# EAGLE design vor_add_on (EAGLE 6.1)
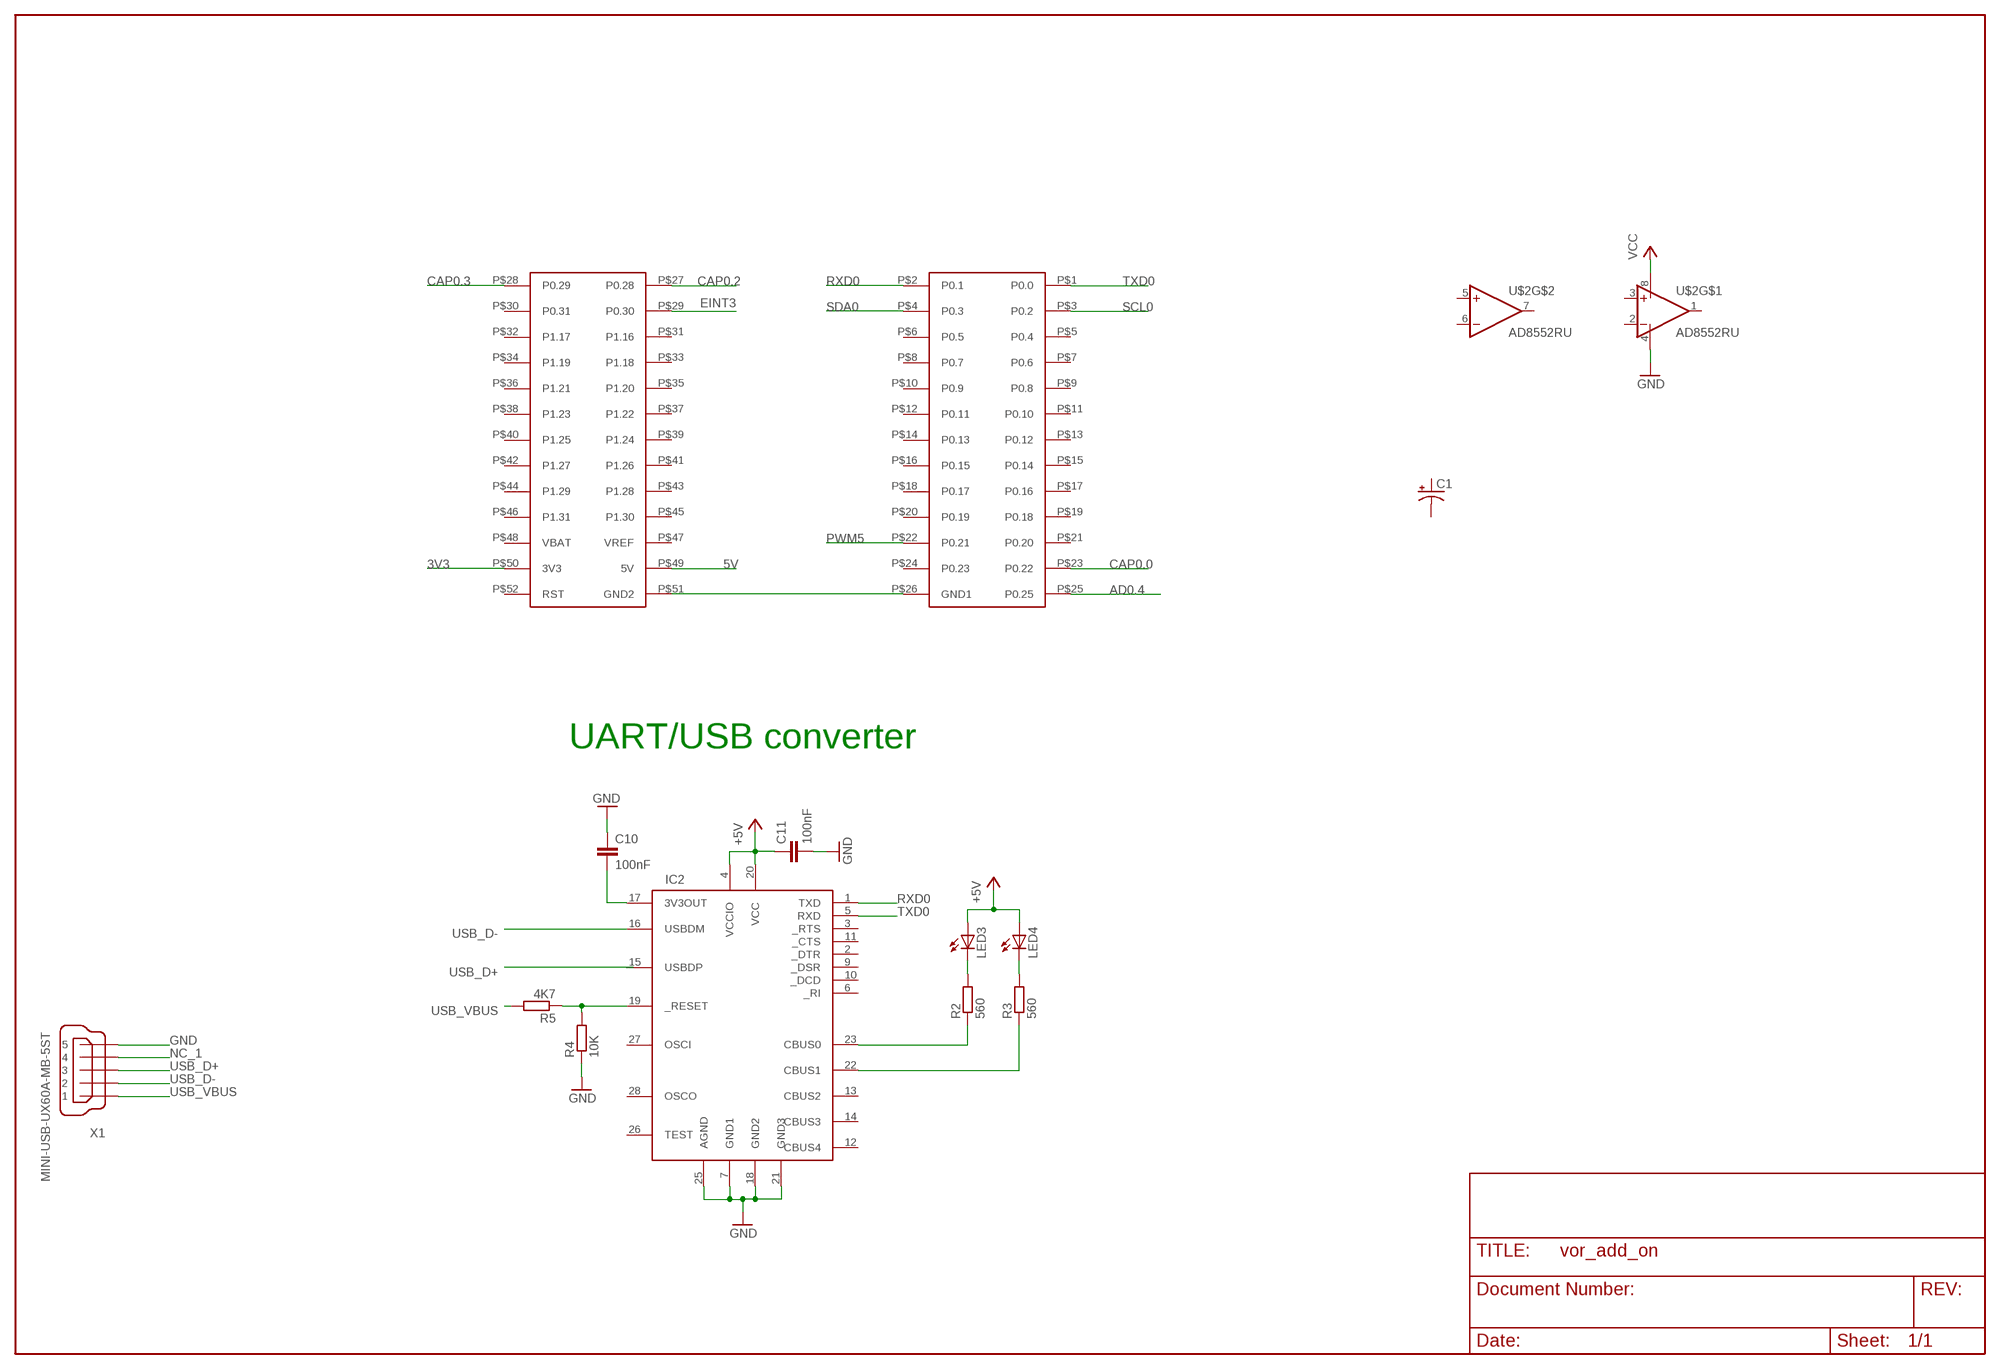
[diagram p0: schematic, sheet 1]

## Parts
C1  CPOL-USCT7343  [CT7343]
C10  100nF  C-EUC0603K  [C0603K]
C11  100nF  C-EUC0603K  [C0603K]
IC2  FT232RL  [SSOP28DB]
LED3  LEDCHIPLED_0805  [CHIPLED_0805]
LED4  LEDCHIPLED_0805  [CHIPLED_0805]
R2  560  R-EU_R0805  [R0805]
R3  560  R-EU_R0805  [R0805]
R4  10K  R-EU_R0603  [R0603]
R5  4K7  R-EU_R0603  [R0603]
U$1  OLIMEX_2148  [OLIMEX_2148]
U$2  AD8552RU  [TSSOP8]
X1  MINI-USB-UX60A-MB-5ST  [UX60A-MB-5ST]

## Nets
3V3: U$1.P$50(3V3)
5V: U$1.P$49(5V)
+5V: C11.1 IC2.4(VCCIO) IC2.20(VCC) LED3.A LED4.A
AD0.4: U$1.P$25(P0.25)
CAP0.0: U$1.P$23(P0.22)
CAP0.2: U$1.P$27(P0.28)
CAP0.3: U$1.P$28(P0.29)
EINT3: U$1.P$29(P0.30)
GND: C10.1 C11.2 IC2.7(GND1) IC2.18(GND2) IC2.21(GND3) IC2.25(AGND) R4.1 U$1.P$26(GND1) U$1.P$51(GND2) U$2.4(V-) X1.5
N$25: IC2.23(CBUS0) R2.1
N$26: IC2.22(CBUS1) R3.1
N$27: LED3.C R2.2
N$28: LED4.C R3.2
N$30: IC2.19(_RESET) R4.2 R5.1
N$32: C10.2 IC2.17(3V3OUT)
NC_1: X1.4
PWM5: U$1.P$22(P0.21)
RXD0: IC2.1(TXD) U$1.P$2(P0.1)
SCL0: U$1.P$3(P0.2)
SDA0: U$1.P$4(P0.3)
TXD0: IC2.5(RXD) U$1.P$1(P0.0)
USB_D+: X1.3
USB_D-: IC2.16(USBDM) X1.2
USB_VBUS: R5.2 X1.1
VCC: U$2.8(V+)
Unconnected: C1.+ C1.- IC2.2(_DTR) IC2.3(_RTS) IC2.6(_RI) IC2.9(_DSR) IC2.10(_DCD) IC2.11(_CTS) IC2.12(CBUS4) IC2.13(CBUS2) IC2.14(CBUS3) IC2.15(USBDP) IC2.26(TEST) IC2.27(OSCI) IC2.28(OSCO) U$1.P$5(P0.4) U$1.P$6(P0.5) U$1.P$7(P0.6) U$1.P$8(P0.7) U$1.P$9(P0.8) U$1.P$10(P0.9) U$1.P$11(P0.10) U$1.P$12(P0.11) U$1.P$13(P0.12) U$1.P$14(P0.13) U$1.P$15(P0.14) U$1.P$16(P0.15) U$1.P$17(P0.16) U$1.P$18(P0.17) U$1.P$19(P0.18) U$1.P$20(P0.19) U$1.P$21(P0.20) U$1.P$24(P0.23) U$1.P$30(P0.31) U$1.P$31(P1.16) U$1.P$32(P1.17) U$1.P$33(P1.18) U$1.P$34(P1.19) U$1.P$35(P1.20) U$1.P$36(P1.21) U$1.P$37(P1.22) U$1.P$38(P1.23) U$1.P$39(P1.24) U$1.P$40(P1.25) U$1.P$41(P1.26) U$1.P$42(P1.27) U$1.P$43(P1.28) U$1.P$44(P1.29) U$1.P$45(P1.30) U$1.P$46(P1.31) U$1.P$47(VREF) U$1.P$48(VBAT) U$1.P$52(RST) U$2.1(OUT) U$2.2(-IN) U$2.3(+IN) U$2.5(+IN) U$2.6(-IN) U$2.7(OUT)

## Notes on the sheet
- UART/USB converter

## Library data of the parts
C1 = rcl:CPOL-US: POLARIZED CAPACITOR, American symbol
C10 C11 = rcl:C-EU: CAPACITOR, European symbol
IC2 = ftdichip:FT232RL: USB UART 4th Generation USB UART (USB <-> Serial) Controller
LED3 LED4 = led:LED: LED OSRAM: - CHIPLED LG R971, LG N971, LY N971, LG Q971, LY Q971, LO R971, LY R971 LH N974, LH R974 LS Q976, LO Q976, LY Q976 LO Q996 - Hyper CHIPLED LW Q18S LB Q993, LB Q99A, LB R99A - SideLED LS A670, LO A670, LY A670, LG A670, LP A670 LB A673, LV A673, LT A673, LW A673 LH A674 LY A675 LS A676, LA A676, LO A676, LY A676, LW A676 LS A679, LY A679, LG A679 - Hyper Micro SIDELED® LS Y876, LA Y876, LO Y876, LY Y876 LT Y87S - SmartLED LW L88C, LW L88S LB L89C, LB L89S, LG L890 LS L89K, LO L89K, LY L89K LS L896, LA L896, LO L896, LY L896 - TOPLED LS T670, LO T670, LY T670, LG T670, LP T670 LSG T670, LSP T670, LSY T670, LOP T670, LYG T670 LG T671, LOG T671, LSG T671 LB T673, LV T673, LT T673, LW T673 LH T674 LS T676, LA T676, LO T676, LY T676, LB T676, LH T676, LSB T676, LW T676 LB T67C, LV T67C, LT T67C, LS T67K, LO T67K, LY T67K, LW E67C LS E67B, LA E67B, LO E67B, LY E67B, LB E67C, LV E67C, LT E67C LW T67C LS T679, LY T679, LG T679 LS T770, LO T770, LY T770, LG T770, LP T770 LB T773, LV T773, LT T773, LW T773 LH T774 LS E675, LA E675, LY E675, LS T675 LS T776, LA T776, LO T776, LY T776, LB T776 LHGB T686 LT T68C, LB T68C - Hyper Mini TOPLED® LB M676 - Mini TOPLED Santana® LG M470 LS M47K, LO M47K, LY M47K Source: http://www.osram.convergy.de/
R2-R5 = rcl:R-EU_: RESISTOR, European symbol
U$1 = paparazzi:OLIMEX_2148
U$2 = paparazzi:AD8552
X1 = con-hirose:MINI-USB-: MINI USB Connector Source: http://www.hirose.co.jp/cataloge_hp/e24000019.pdf

## Net classes
1 Supply: width 1.016 mm, drill 0.762 mm, clearance 0.635 mm

## Board
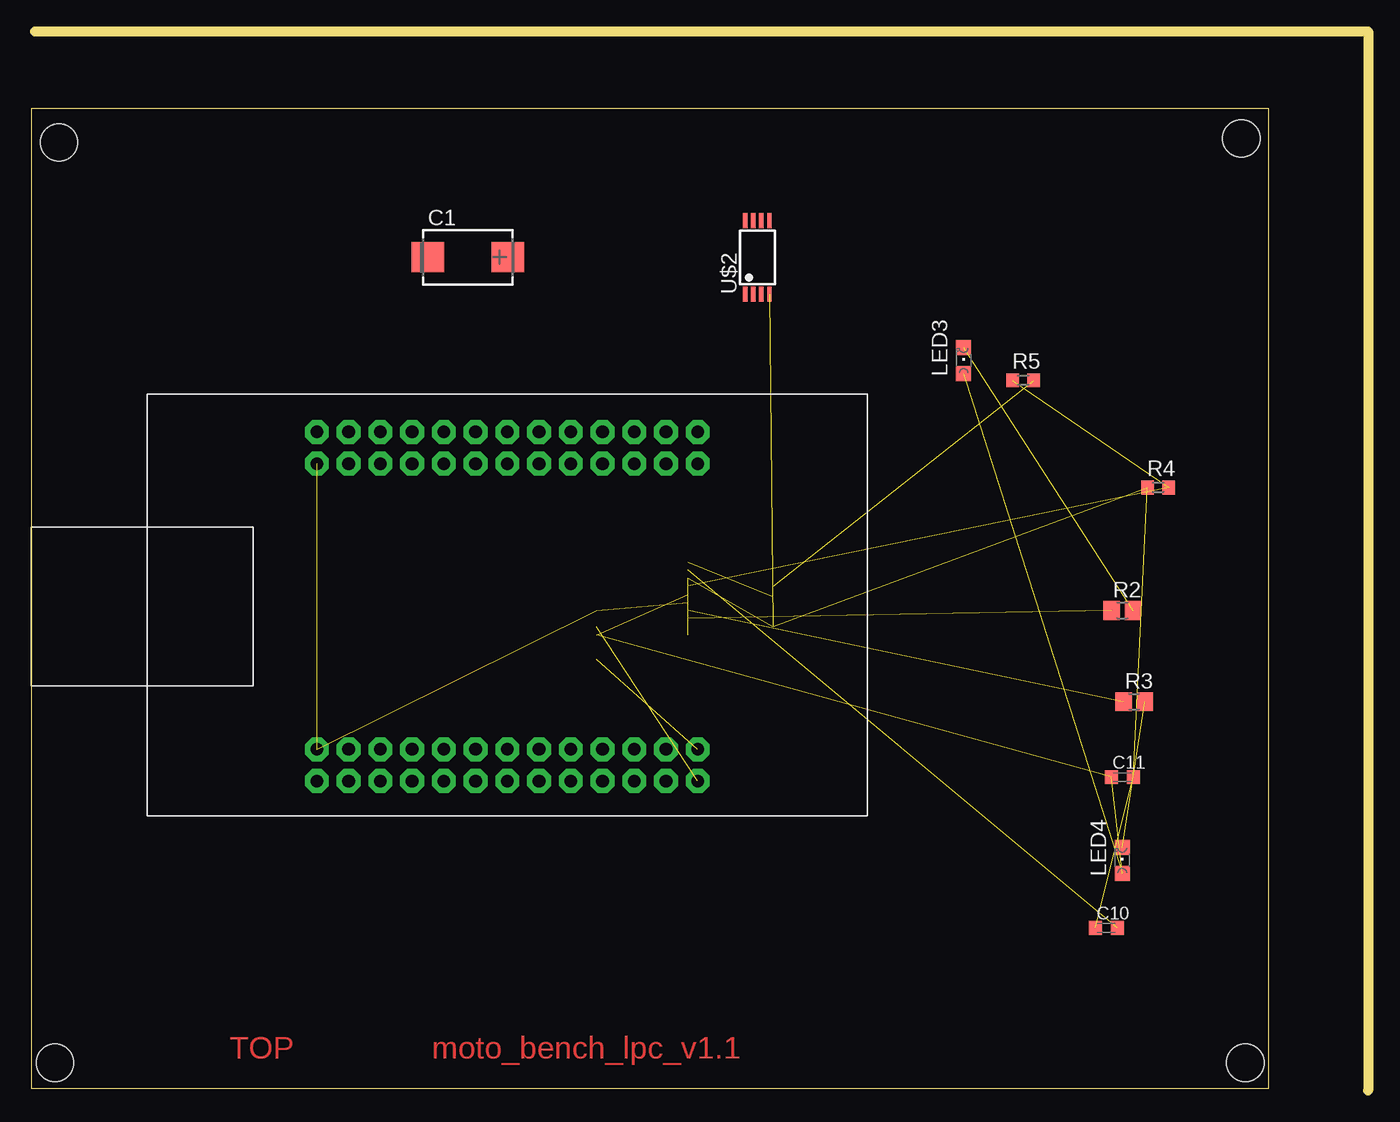
[diagram p1: board, top side]
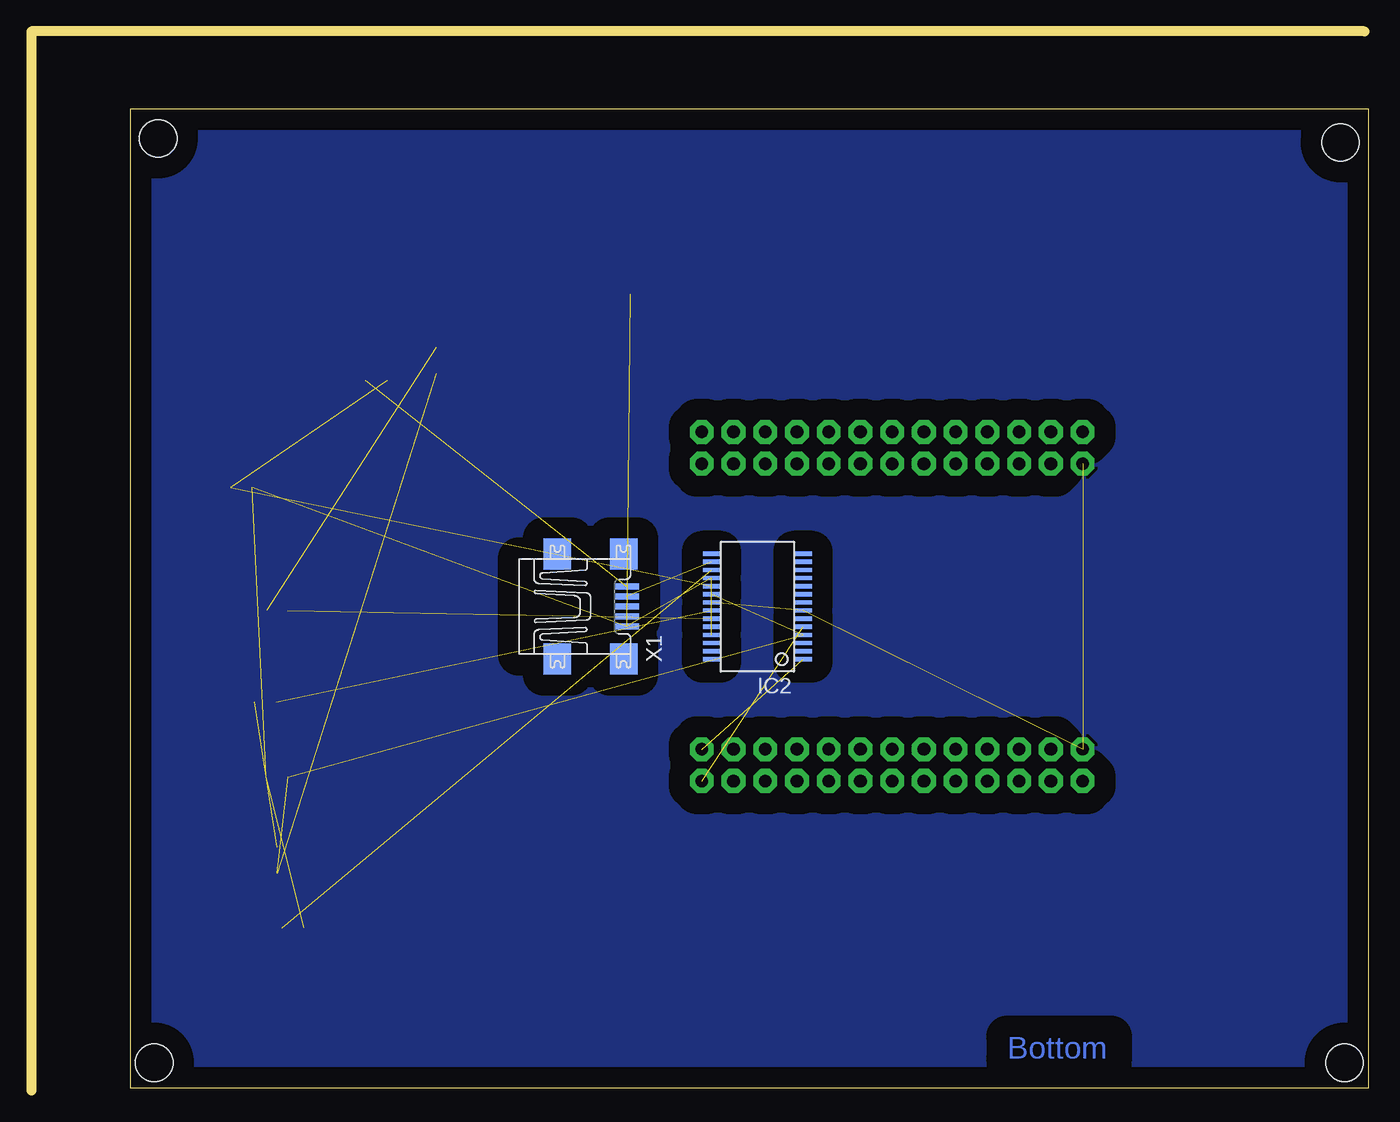
[diagram p2: board, bottom side, seen from below]

Size 106.99 x 84.77 mm. Coordinates in mm from the lower left corner, seen from the top.
Outline: 0.31,84.77 106.99,84.77 106.99,0
Outline: 0,0.17 99.04,0.17 99.04,78.58 0,78.58 0,0.17
Copper layers (1*16): Top 0.035mm / dielectric 1.5mm / Bottom 0.035mm
Design rules: minimum track width 20mil, minimum drill 0.8mm, track to track 20mil, track to pad 15mil, pad to pad 15mil, via to via 20mil, smd to smd 10mil, copper to edge 40mil, drill to drill 8mil, minimum pad ring 10mil, minimum via ring 20mil, stop-mask expansion 4mil, vias tented up to drill 0mil, thermal gap 10mil
Holes 3 mm at 96.83,76.2 2.22,75.88 1.9,2.22 97.15,2.22
tRestrict: area 17.5,22.2 to 58.7,30.2; area 17.1,47.3 to 58.4,55.2

### Footprints (pad centres in the part's own frame; a part is rotated, then mirrored left to right if it is on the bottom)
CT7343 = smd 2.6 x 2.4: + 3.2,0; - -3.2,0
C0603K = smd 1.05 x 1.08: 1 -0.875,0; 2 0.875,0
SSOP28DB = smd 0.348 x 1.397: 1 -4.225,-3.656; 2 -3.575,-3.656; 3 -2.925,-3.656; 4 -2.275,-3.656; 5 -1.625,-3.656; 6 -0.975,-3.656; 7 -0.325,-3.656; 8 0.325,-3.656; 9 0.975,-3.656; 10 1.625,-3.656; 11 2.275,-3.656; 12 2.925,-3.656; 13 3.575,-3.656; 14 4.225,-3.656; 15 4.225,3.656; 16 3.575,3.656; 17 2.925,3.656; 18 2.275,3.656; 19 1.625,3.656; 20 0.975,3.656; 21 0.325,3.656; 22 -0.325,3.656; 23 -0.975,3.656; 24 -1.625,3.656; 25 -2.275,3.656; 26 -2.925,3.656; 27 -3.575,3.656; 28 -4.225,3.656
CHIPLED_0805 = smd 1.2 x 1.2: A 0,-1.05; C 0,1.05
R0805 = smd 1.3 x 1.5: 1 -0.85,0; 2 0.85,0
R0603 = smd 1 x 1.1: 1 -0.85,0; 2 0.85,0
OLIMEX_2148 = drill 1.016 pad 1.905 octagon: P$1 15.24,-13.97; P$2 15.24,-11.43; P$3 12.7,-13.97; P$4 12.7,-11.43; P$5 10.16,-13.97; P$6 10.16,-11.43; P$7 7.62,-13.97; P$8 7.62,-11.43; P$9 5.08,-13.97; P$10 5.08,-11.43; P$11 2.54,-13.97; P$12 2.54,-11.43; P$13 0,-13.97; P$14 0,-11.43; P$15 -2.54,-13.97; P$16 -2.54,-11.43; P$17 -5.08,-13.97; P$18 -5.08,-11.43; P$19 -7.62,-13.97; P$20 -7.62,-11.43; P$21 -10.16,-13.97; P$22 -10.16,-11.43; P$23 -12.7,-13.97; P$24 -12.7,-11.43; P$25 -15.24,-13.97; P$26 -15.24,-11.43; P$27 15.24,11.43; P$28 15.24,13.97; P$29 12.7,11.43; P$30 12.7,13.97; P$31 10.16,11.43; P$32 10.16,13.97; P$33 7.62,11.43; P$34 7.62,13.97; P$35 5.08,11.43; P$36 5.08,13.97; P$37 2.54,11.43; P$38 2.54,13.97; P$39 0,11.43; P$40 0,13.97; P$41 -2.54,11.43; P$42 -2.54,13.97; P$43 -5.08,11.43; P$44 -5.08,13.97; P$45 -7.62,11.43; P$46 -7.62,13.97; P$47 -10.16,11.43; P$48 -10.16,13.97; P$49 -12.7,11.43; P$50 -12.7,13.97; P$51 -15.24,11.43; P$52 -15.24,13.97
TSSOP8 = smd 0.35 x 1.2: 1 -0.975,-2.925; 2 -0.325,-2.925; 3 0.325,-2.925; 4 0.975,-2.925; 5 0.975,2.925; 6 0.325,2.925; 7 -0.325,2.925; 8 -0.975,2.925
UX60A-MB-5ST = smd 2 x 0.5: 1 2.25,1.6; 2 2.25,0.8; 3 2.25,0; 4 2.25,-0.8; 5 2.25,-1.6 | smd 2.2 x 2.5: M1 -3.3,-4.2; M2 -3.3,4.2; M3 2,4.2; M4 2,-4.2

### Placement (x,y rotation side)
C1  34.92,66.68 0 top
C10  86.04,13.02 0 top
C11  87.31,25.08 0 top
IC2  48.89,38.73 90 bottom
LED3  74.61,58.42 0 top
LED4  87.31,18.42 0 top
R2  87.31,38.42 0 top
R3  88.26,31.12 0 top
R4  90.16,48.26 0 top
R5  79.37,56.83 0 top
U$1  38.1,38.73 0 top
U$2  58.1,66.68 0 top
X1  61.59,38.73 0 bottom

### Tracks (layer width: path | path; a pad name or v marks a point on that pad's centre or on a via)
+5V  (4 unrouted)
GND  (10 unrouted)
  pour Bottom (isolate 1.676): -0.01,0.64 -0.01,78.42 0.31,78.74 98.74,78.74 99.37,78.11 99.37,0.64 99.05,0.32 -0.01,0.32 -0.01,0.95
N$25  (1 unrouted)
N$26  (1 unrouted)
N$27  (1 unrouted)
N$28  (1 unrouted)
N$30  (2 unrouted)
N$32  (1 unrouted)
RXD0  (1 unrouted)
TXD0  (1 unrouted)
USB_D-  (1 unrouted)
USB_VBUS  (1 unrouted)

### Text on the board
Top: TOP | moto_bench_lpc_v1.1
Bottom: Bottom